# EAGLE design untitled (EAGLE 9.6.2)
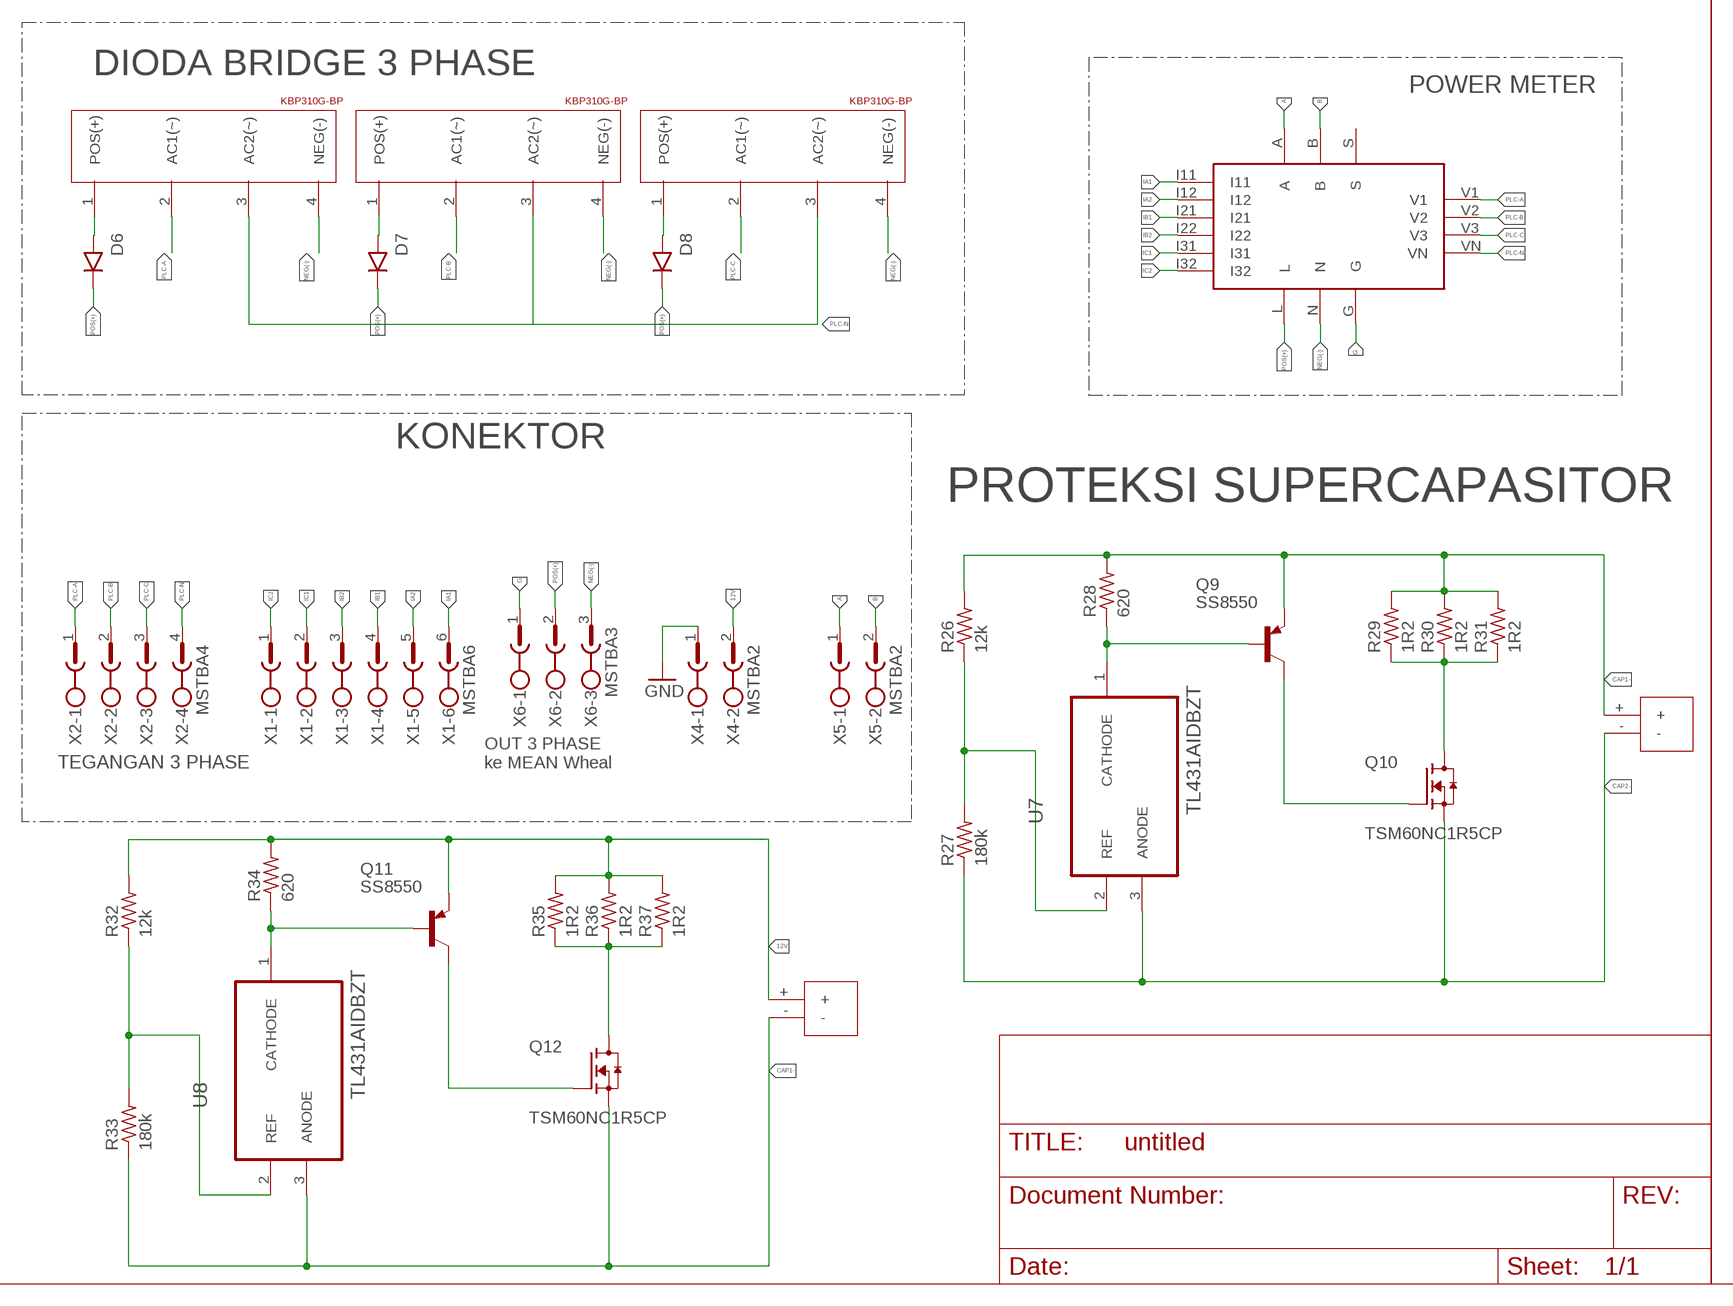
[diagram p0: schematic, sheet 1, part 1 of 2]
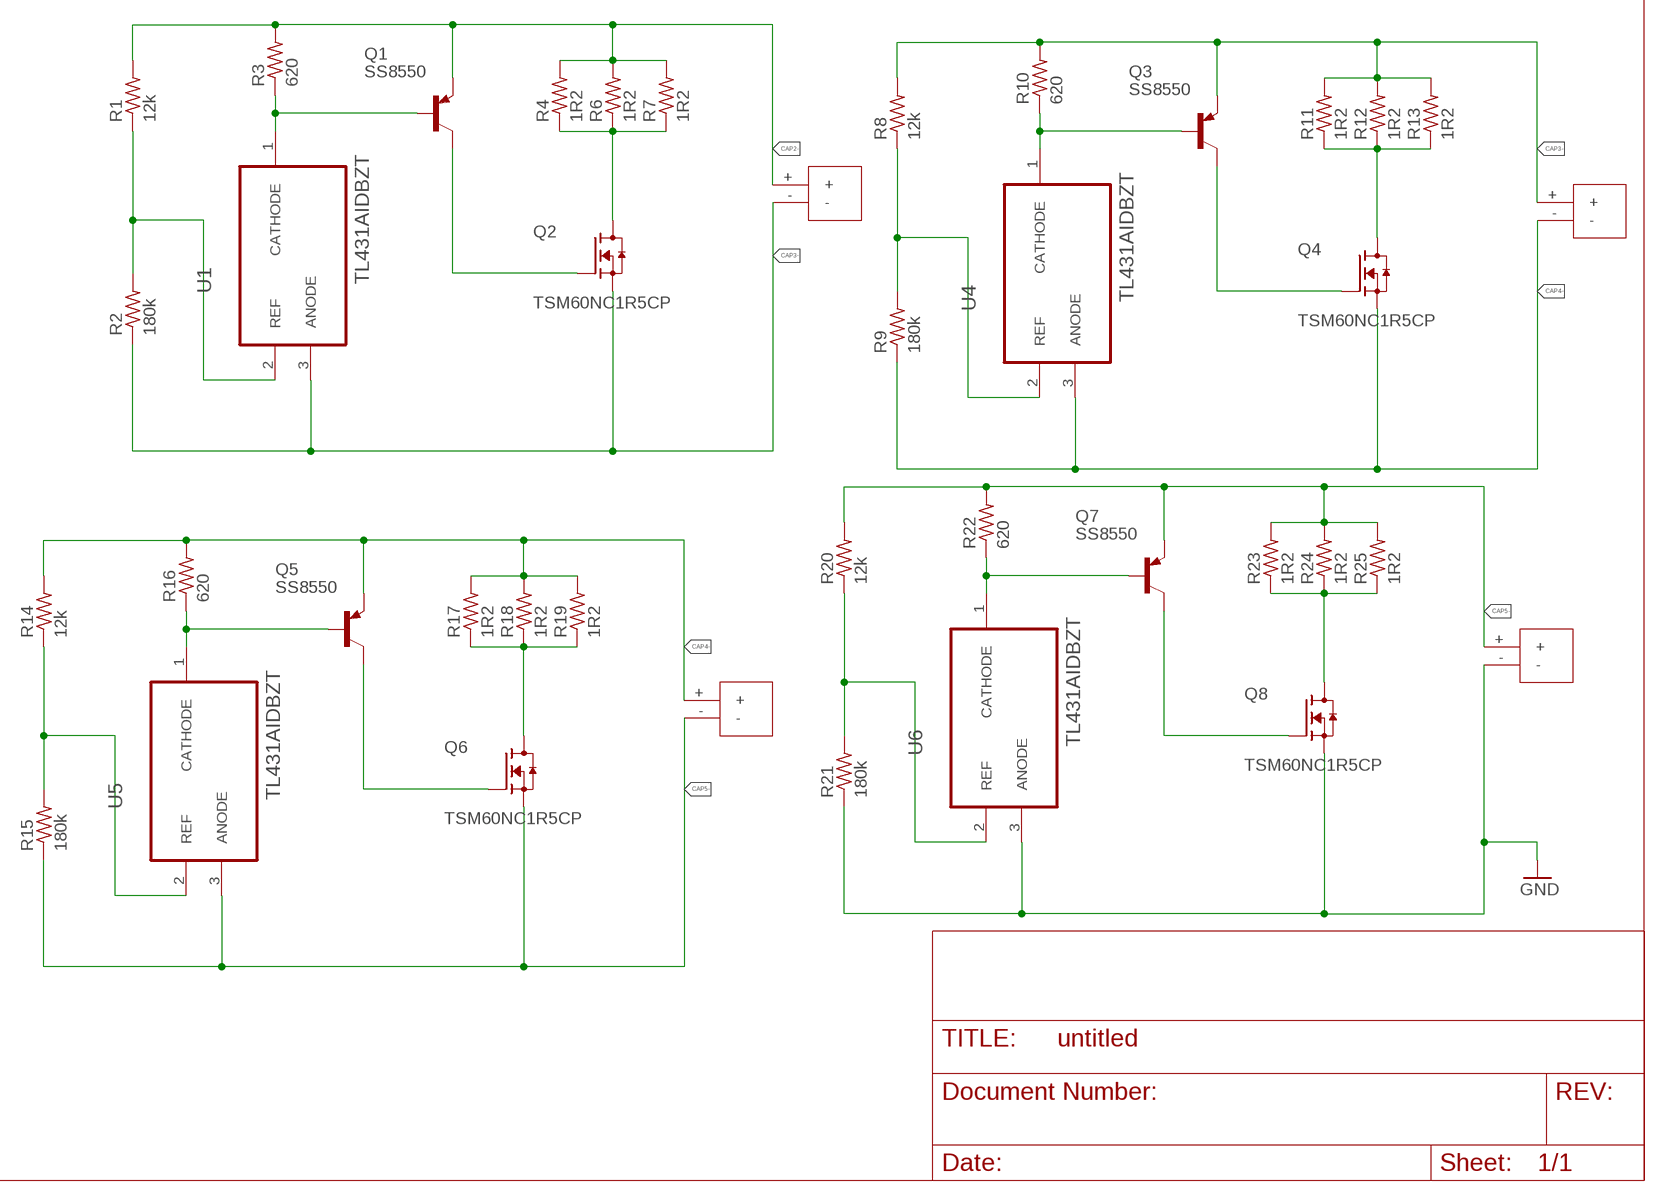
[diagram p1: schematic, sheet 1, part 2 of 2]

## Parts
D6  1N4001  [DO41-10]
D7  1N4001  [DO41-10]
D8  1N4001  [DO41-10]
POWERMETER1  POWERMETER  [POWERMETER]
Q1  SS8550  [SOT-23_BEC]
Q2  TSM60NC1R5CP  [TRANS_TSM60NC1R5CP]
Q3  SS8550  [SOT-23_BEC]
Q4  TSM60NC1R5CP  [TRANS_TSM60NC1R5CP]
Q5  SS8550  [SOT-23_BEC]
Q6  TSM60NC1R5CP  [TRANS_TSM60NC1R5CP]
Q7  SS8550  [SOT-23_BEC]
Q8  TSM60NC1R5CP  [TRANS_TSM60NC1R5CP]
Q9  SS8550  [SOT-23_BEC]
Q10  TSM60NC1R5CP  [TRANS_TSM60NC1R5CP]
Q11  SS8550  [SOT-23_BEC]
Q12  TSM60NC1R5CP  [TRANS_TSM60NC1R5CP]
R1  12k  R-US_R0805  [R0805]
R2  180k  R-US_R0805  [R0805]
R3  620  R-US_R0805  [R0805]
R4  1R2  R-US_R2512  [R2512]
R6  1R2  R-US_R2512  [R2512]
R7  1R2  R-US_R2512  [R2512]
R8  12k  R-US_R0805  [R0805]
R9  180k  R-US_R0805  [R0805]
R10  620  R-US_R0805  [R0805]
R11  1R2  R-US_R2512  [R2512]
R12  1R2  R-US_R2512  [R2512]
R13  1R2  R-US_R2512  [R2512]
R14  12k  R-US_R0805  [R0805]
R15  180k  R-US_R0805  [R0805]
R16  620  R-US_R0805  [R0805]
R17  1R2  R-US_R2512  [R2512]
R18  1R2  R-US_R2512  [R2512]
R19  1R2  R-US_R2512  [R2512]
R20  12k  R-US_R0805  [R0805]
R21  180k  R-US_R0805  [R0805]
R22  620  R-US_R0805  [R0805]
R23  1R2  R-US_R2512  [R2512]
R24  1R2  R-US_R2512  [R2512]
R25  1R2  R-US_R2512  [R2512]
R26  12k  R-US_R0805  [R0805]
R27  180k  R-US_R0805  [R0805]
R28  620  R-US_R0805  [R0805]
R29  1R2  R-US_R2512  [R2512]
R30  1R2  R-US_R2512  [R2512]
R31  1R2  R-US_R2512  [R2512]
R32  12k  R-US_R0805  [R0805]
R33  180k  R-US_R0805  [R0805]
R34  620  R-US_R0805  [R0805]
R35  1R2  R-US_R2512  [R2512]
R36  1R2  R-US_R2512  [R2512]
R37  1R2  R-US_R2512  [R2512]
SUPERCAP1  2.7/500F  SUPERCAP  [SUPERCAP]
SUPERCAP2  2.7/500F  SUPERCAP  [SUPERCAP]
SUPERCAP3  2.7/500F  SUPERCAP  [SUPERCAP]
SUPERCAP4  2.7/500F  SUPERCAP  [SUPERCAP]
SUPERCAP5  2.7/500F  SUPERCAP  [SUPERCAP]
SUPERCAP6  2.7/500F  SUPERCAP  [SUPERCAP]
U1  TL431AIDBZT  [SOT95P237X112-3N]
U4  TL431AIDBZT  [SOT95P237X112-3N]
U5  TL431AIDBZT  [SOT95P237X112-3N]
U6  TL431AIDBZT  [SOT95P237X112-3N]
U7  TL431AIDBZT  [SOT95P237X112-3N]
U8  TL431AIDBZT  [SOT95P237X112-3N]
U$1  KBP310G-BP  [KBP310G-BP]
U$2  KBP310G-BP  [KBP310G-BP]
U$3  KBP310G-BP  [KBP310G-BP]
X1  MSTBA6  [MSTBA6]
X2  MSTBA4  [MSTBA4]
X4  MSTBA2  [MSTBA2]
X5  MSTBA2  [MSTBA2]
X6  MSTBA3  [MSTBA3]

## Nets
12V: Q11.E R32.2 R34.2 R35.2 R36.2 R37.2 SUPERCAP6.+ X4.2
A: POWERMETER1.A X5.1
B: POWERMETER1.B X5.2
CAP1-: Q9.E Q12.3(S) R26.2 R28.2 R29.2 R30.2 R31.2 R33.1 SUPERCAP5.+ SUPERCAP6.- U8.3(ANODE)
CAP2-: Q1.E Q10.3(S) R1.2 R3.2 R4.2 R6.2 R7.2 R27.1 SUPERCAP1.+ SUPERCAP5.- U7.3(ANODE)
CAP3-: Q2.3(S) Q3.E R2.1 R8.2 R10.2 R11.2 R12.2 R13.2 SUPERCAP1.- SUPERCAP2.+ U1.3(ANODE)
CAP4-: Q4.3(S) Q5.E R9.1 R14.2 R16.2 R17.2 R18.2 R19.2 SUPERCAP2.- SUPERCAP3.+ U4.3(ANODE)
CAP5-: Q6.3(S) Q7.E R15.1 R20.2 R22.2 R23.2 R24.2 R25.2 SUPERCAP3.- SUPERCAP4.+ U5.3(ANODE)
G: POWERMETER1.G X6.1
GND: Q8.3(S) R21.1 SUPERCAP4.- U6.3(ANODE) X4.1
IA1: POWERMETER1.I11 X1.6
IA2: POWERMETER1.I12 X1.5
IB1: POWERMETER1.I21 X1.4
IB2: POWERMETER1.I22 X1.3
IC1: POWERMETER1.I31 X1.2
IC2: POWERMETER1.I32 X1.1
N$1: D6.A(ANODE) U$1.1(POS(+))
N$2: D7.A(ANODE) U$2.1(POS(+))
N$3: D8.A(ANODE) U$3.1(POS(+))
N$4: R8.1 R9.2 U4.2(REF)
N$6: R1.1 R2.2 U1.2(REF)
N$18: Q1.B R3.1 U1.1(CATHODE)
N$20: Q1.C Q2.1(G)
N$21: Q2.2(D) R4.1 R6.1 R7.1
N$25: Q3.B R10.1 U4.1(CATHODE)
N$26: Q3.C Q4.1(G)
N$27: Q4.2(D) R11.1 R12.1 R13.1
N$29: R14.1 R15.2 U5.2(REF)
N$31: Q5.B R16.1 U5.1(CATHODE)
N$32: Q5.C Q6.1(G)
N$33: Q6.2(D) R17.1 R18.1 R19.1
N$35: R20.1 R21.2 U6.2(REF)
N$37: Q7.B R22.1 U6.1(CATHODE)
N$38: Q7.C Q8.1(G)
N$39: Q8.2(D) R23.1 R24.1 R25.1
N$41: R26.1 R27.2 U7.2(REF)
N$43: Q9.B R28.1 U7.1(CATHODE)
N$44: Q9.C Q10.1(G)
N$45: Q10.2(D) R29.1 R30.1 R31.1
N$47: R32.1 R33.2 U8.2(REF)
N$49: Q11.B R34.1 U8.1(CATHODE)
N$50: Q11.C Q12.1(G)
N$51: Q12.2(D) R35.1 R36.1 R37.1
NEG(-): POWERMETER1.N U$1.4(NEG(-)) U$2.4(NEG(-)) U$3.4(NEG(-)) X6.3
PLC-A: POWERMETER1.V1 U$1.2(AC1(~)) X2.1
PLC-B: POWERMETER1.V2 U$2.2(AC1(~)) X2.2
PLC-C: POWERMETER1.V3 U$3.2(AC1(~)) X2.3
PLC-N: POWERMETER1.VN U$1.3(AC2(~)) U$2.3(AC2(~)) U$3.3(AC2(~)) X2.4
POS(+): D6.C(CATHODE) D7.C(CATHODE) D8.C(CATHODE) POWERMETER1.L X6.2
Unconnected: POWERMETER1.S

## Notes on the sheet
- DIODA BRIDGE 3 PHASE
- POWER METER
- KONEKTOR
- PROTEKSI SUPERCAPASITOR
- TEGANGAN 3 PHASE
- OUT 3 PHASE 
  ke MEAN Wheal

## Library data of the parts
D6-D8 = 1N4001:1N4001: DIODE general purpose rectifier, 1 A Check availability <https://pricing.snapeda.com/parts/1N4001/HVCA/view-part?ref=eda>; AVAILABILITY: In Stock; CHECK_PRICES: https://www.snapeda.com/parts/1N4001/HVCA/view-part/?ref=eda; DESCRIPTION: Diode, Rectifier, Vr 50V, If 1A, Pkg DO-41, Vf 1.1V, Cs 30A, Ir 1A | HVCA 1N4001; MF: HVCA; MP: 1N4001; PACKAGE: None; PRICE: None; SNAPEDA_LINK: https://www.snapeda.com/parts/1N4001/HVCA/view-part/?ref=snap
POWERMETER1 = POWERMETER:POWERMETER
Q1 Q3 Q5 Q7 Q9 Q11 = SS8550:SS8550: PNP de proposito general Vce=-40V, Ic-1.5A - 0.3W Check availability <https://pricing.snapeda.com/parts/SS8550/ON%20Semiconductor%20/%20Fairchild/view-part?ref=eda>; AVAILABILITY: In Stock; DESCRIPTION: Bipolar Transistors - BJT NPN/40V/1.5A; MF: ON Semiconductor / Fairchild; MP: SS8550; PACKAGE: SOT-23 ON Semiconductor / Fairchild; PRICE: None; PURCHASE-URL: https://pricing.snapeda.com/search/part/SS8550/?ref=eda
Q2 Q4 Q6 Q8 Q10 Q12 = TSM60NC1R5CP:TSM60NC1R5CP: Check availability <https://pricing.snapeda.com/parts/TSM60NC1R5CP/Taiwan%20Semiconductor/view-part?ref=eda>; AVAILABILITY: In Stock; CHECK_PRICES: https://www.snapeda.com/parts/TSM60NC1R5CP/Taiwan+Semiconductor/view-part/?ref=eda; DESCRIPTION: 600V, 3A, SINGLE N-CHANNEL POWER; MF: Taiwan Semiconductor; MP: TSM60NC1R5CP; PACKAGE: TO-252 Taiwan Semiconductor; PRICE: None; SNAPEDA_LINK: https://www.snapeda.com/parts/TSM60NC1R5CP/Taiwan+Semiconductor/view-part/?ref=snap
R1-R3 R8-R10 R14-R16 R20-R22 R26-R28 R32-R34 = adafruit:R-US_: RESISTOR, American symbol
R4 R6 R7 R11-R13 R17-R19 R23-R25 R29-R31 R35-R37 = rcl:R-US_: RESISTOR, American symbol; SPICEPREFIX: R
SUPERCAP1-SUPERCAP6 = SUPERCAP:SUPERCAP
U1 U4-U8 = TL431AIDBZT:TL431AIDBZT: PRECISION PROGRAMMABLE REFERENCE Check availability <https://pricing.snapeda.com/parts/TL431AIDBZT/Texas%20Instruments/view-part?ref=eda>; AVAILABILITY: In Stock; CHECK_PRICES: https://www.snapeda.com/parts/TL431AIDBZT/Texas+Instruments/view-part/?ref=eda; DESCRIPTION: Adjustable precision shunt regulator; MF: Texas Instruments; MP: TL431AIDBZT; PACKAGE: SOT-23-3 Texas Instruments; PRICE: None; SNAPEDA_LINK: https://www.snapeda.com/parts/TL431AIDBZT/Texas+Instruments/view-part/?ref=snap
U$1-U$3 = KBP310G-BP:KBP310G-BP: Check availability <https://pricing.snapeda.com/parts/KBP310G-BP/Micro%20Commercial/view-part?ref=eda>; AVAILABILITY: In Stock; CHECK_PRICES: https://www.snapeda.com/parts/KBP310G-BP/Micro+Commercial+Components/view-part/?ref=eda; DESCRIPTION: Bridge Rectifier Single Phase Standard 1 kV Through Hole GBP; MF: Micro Commercial; MP: KBP310G-BP; PACKAGE: SIP-4 Micro Commercial Co; PRICE: None; SNAPEDA_LINK: https://www.snapeda.com/parts/KBP310G-BP/Micro+Commercial+Components/view-part/?ref=snap
X1 = con-phoenix-508:MSTBA6: PHOENIX; MF: FARNELL; MPN: 1757284; OC_FARNELL: 3705213; OC_NEWARK: 71C4165
X2 = con-phoenix-508:MSTBA4: PHOENIX; MF: FARNELL; MPN: 1757268; OC_FARNELL: 3705195; OC_NEWARK: 71C4163
X4 X5 = con-phoenix-508:MSTBA2: PHOENIX; MF: FARNELL; MPN: 1757242; OC_FARNELL: 3705171; OC_NEWARK: 71C4161
X6 = con-phoenix-508:MSTBA3: PHOENIX; MF: FARNELL; MPN: 1757255; OC_FARNELL: 3705183; OC_NEWARK: 71C4162

## Board
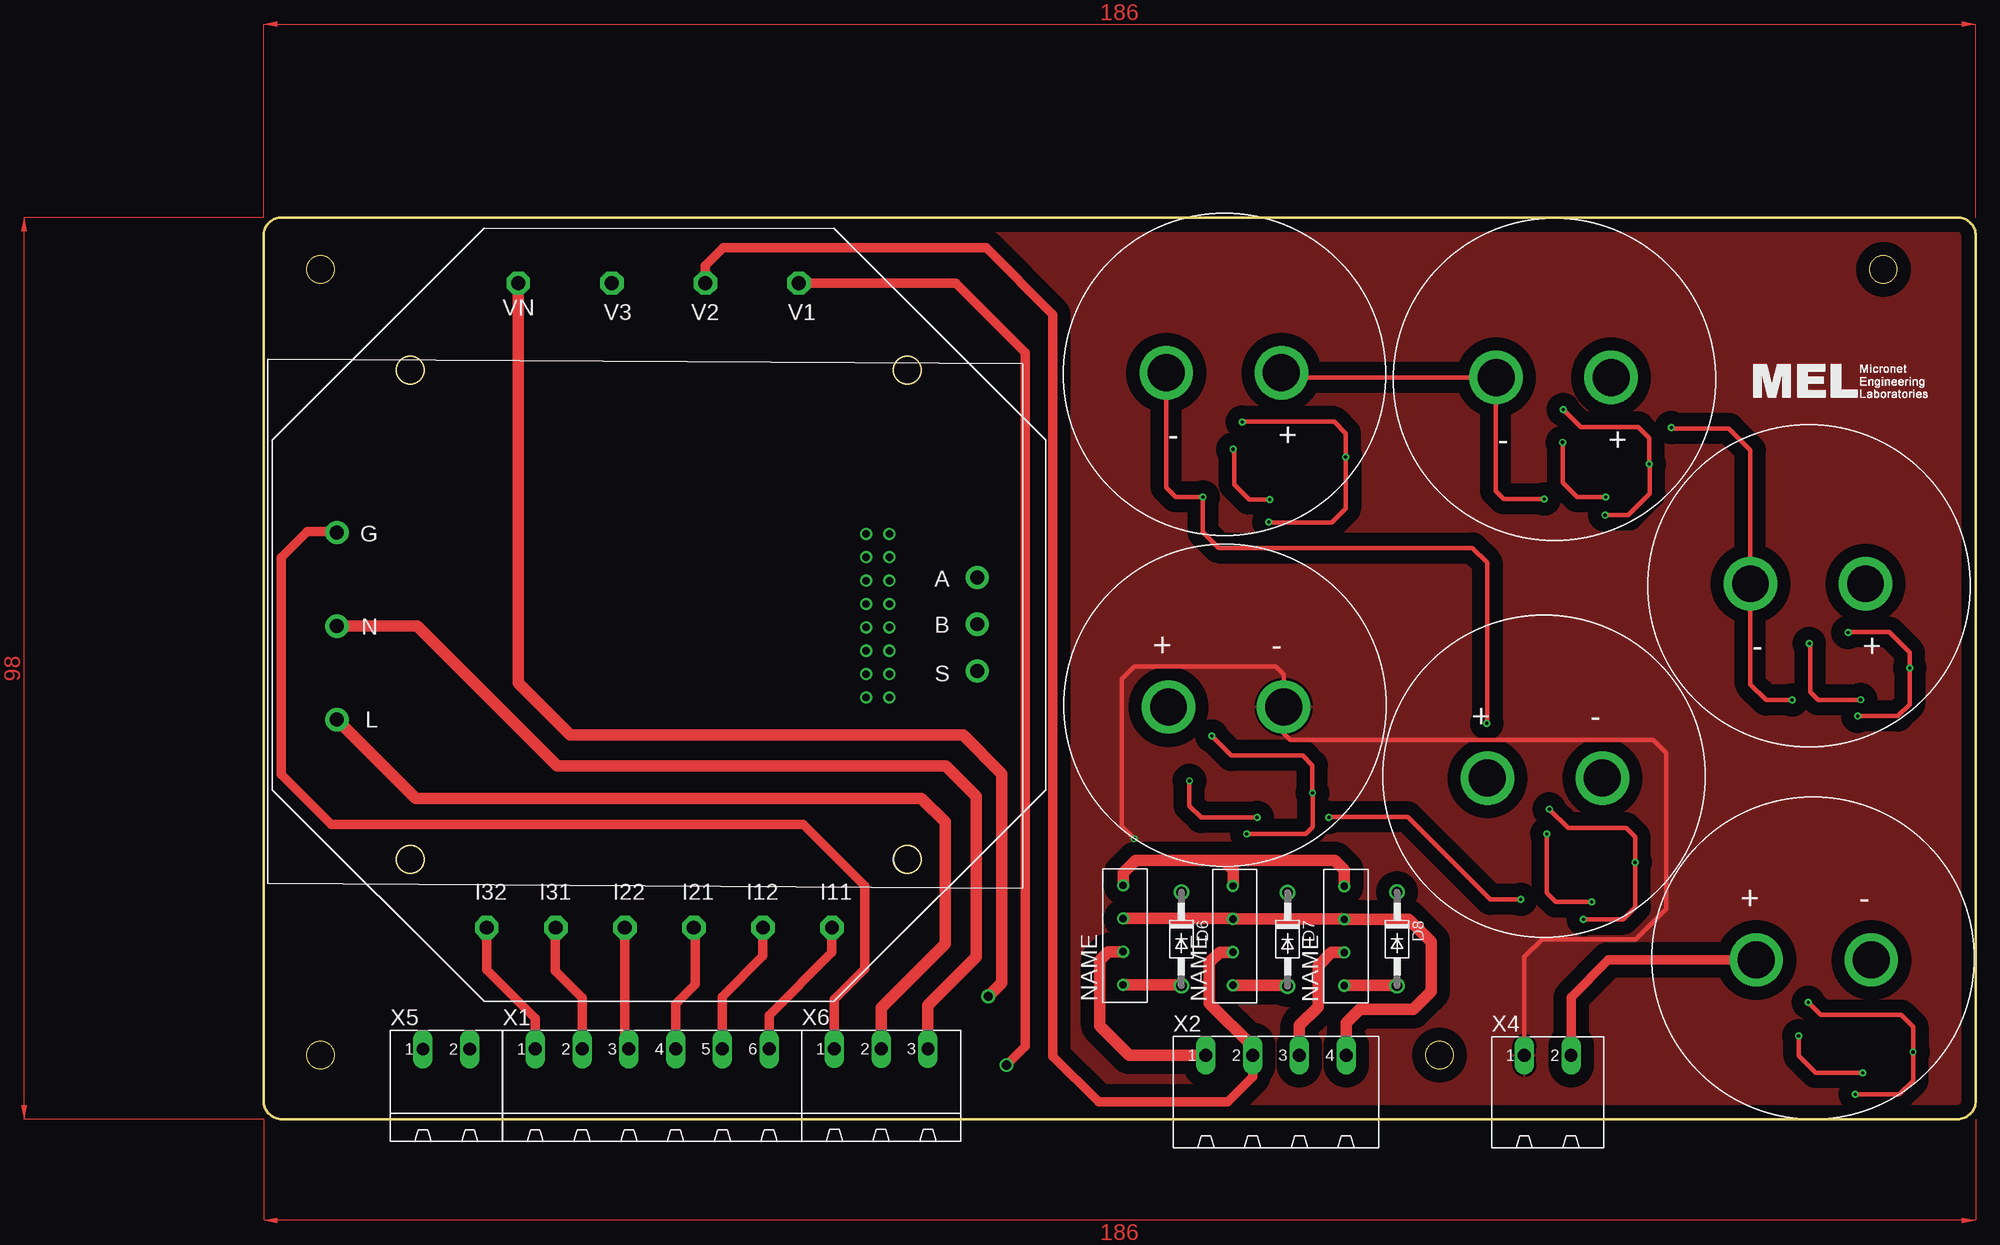
[diagram p2: board, top side]
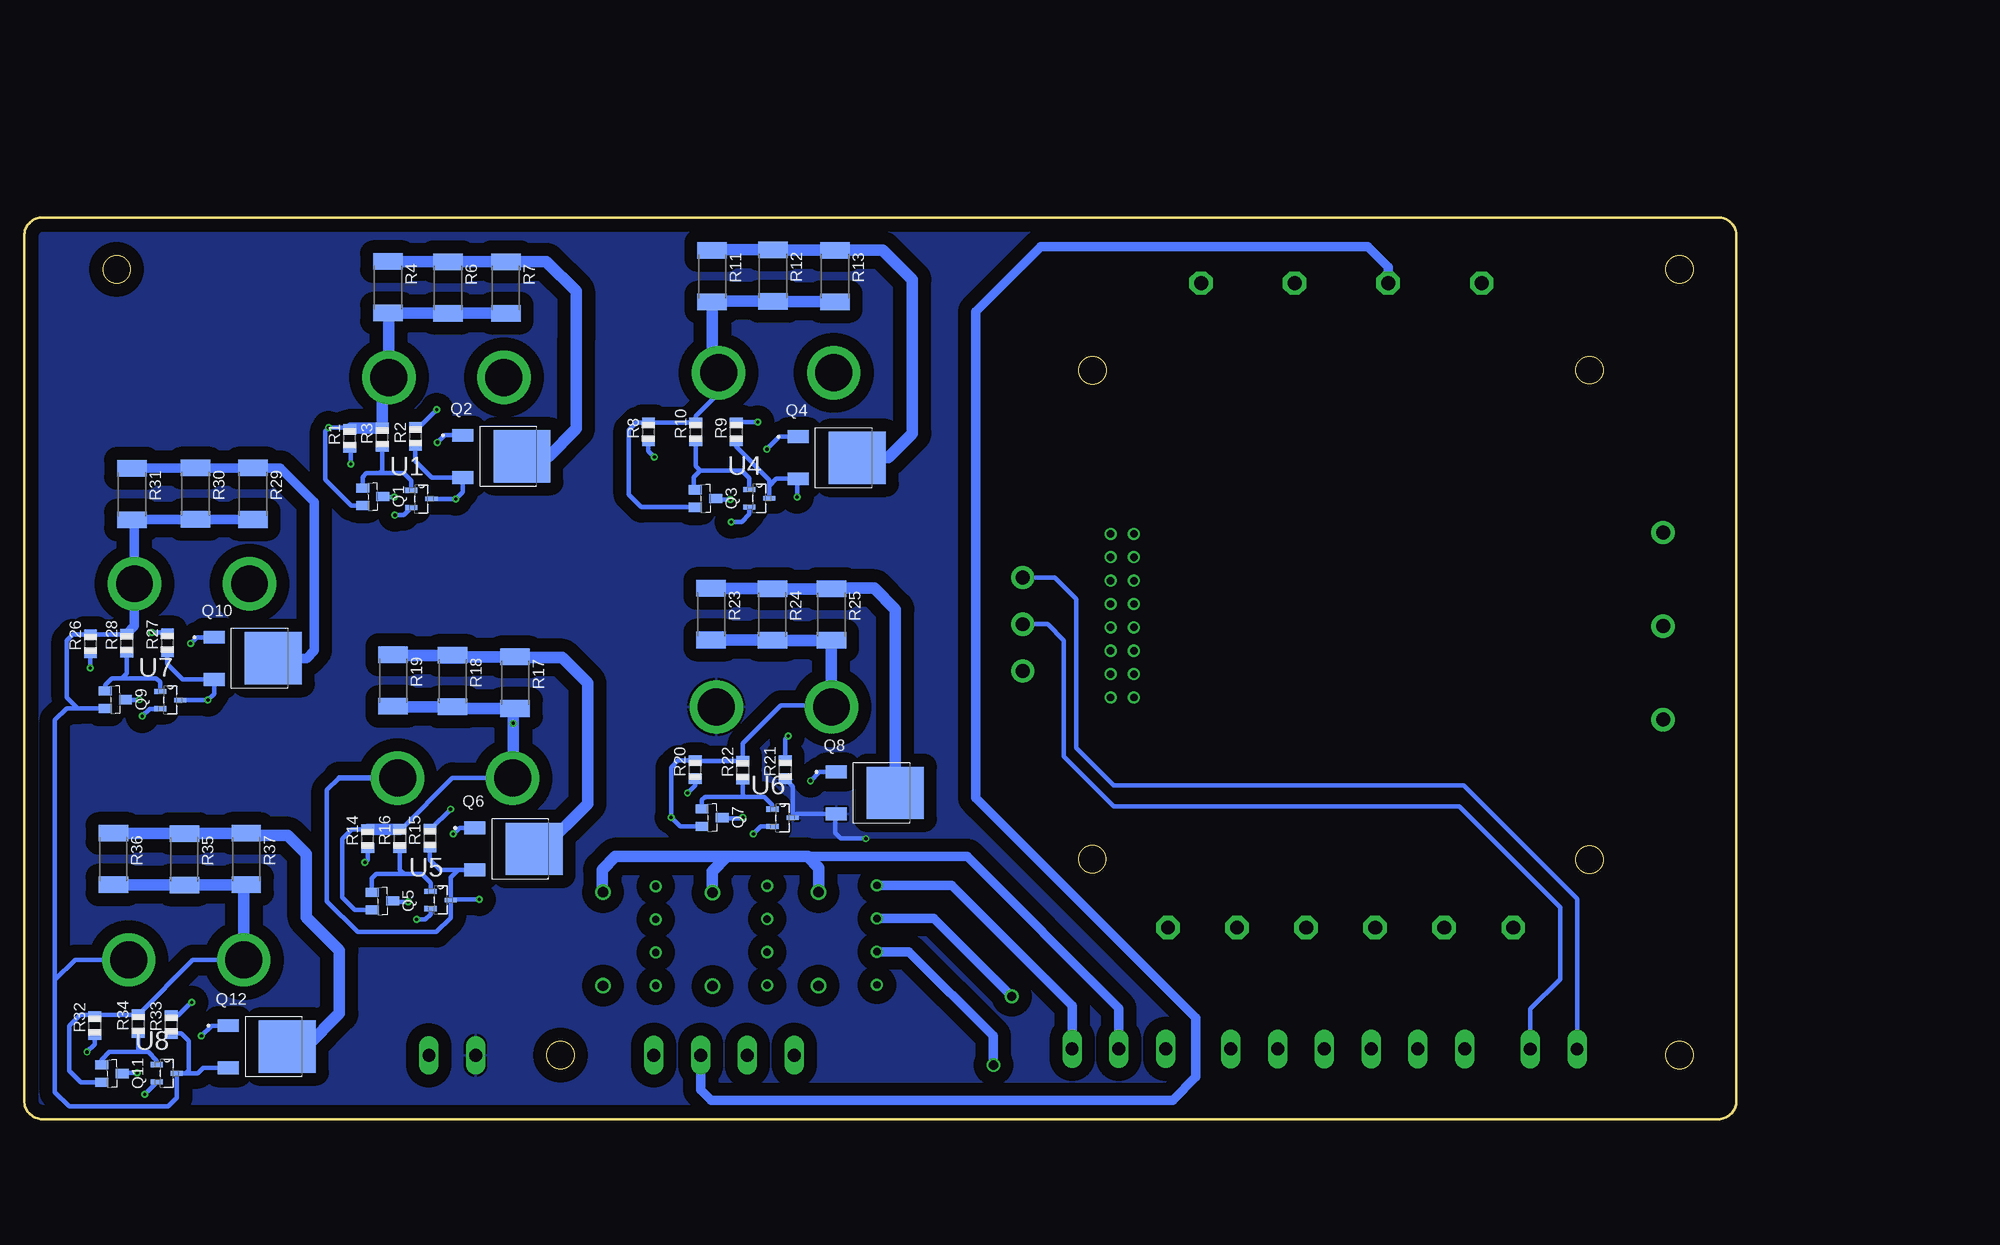
[diagram p3: board, bottom side, seen from below]

Size 186 x 98 mm. Coordinates in mm from the lower left corner, seen from the top.
Outline: 186,2 arc-90 184,0 2,0 arc-90 0,2 0,96 arc-90 2,98 184,98 arc-90 186,96 186,2
Outline: circle at 15.96,81.41 radius 1.5
Outline: circle at 69.95,81.39 radius 1.5
Outline: circle at 69.98,28.26 radius 1.5
Outline: circle at 15.96,28.23 radius 1.5
Outline: circle at 6.21,6.97 radius 1.5
Outline: circle at 6.21,92.34 radius 1.5
Outline: circle at 175.95,92.34 radius 1.5
Outline: circle at 127.75,6.97 radius 1.5
Copper layers (1*16): Top 0.035mm / dielectric 1.5mm / Bottom 0.035mm
Design rules "default": minimum track width 6mil, minimum drill 0.35mm, track to track 6mil, track to pad 6mil, pad to pad 6mil, via to via 6mil, smd to smd 6mil, copper to edge 40mil, drill to drill 6mil, minimum pad ring 10mil, minimum via ring 8mil, stop-mask expansion 4mil, vias tented up to drill 0mil, thermal gap 10mil

### Footprints (pad centres in the part's own frame; a part is rotated, then mirrored left to right if it is on the bottom)
DO41-10 = drill 1.118: A 5.08,0; C -5.08,0
POWERMETER = drill 1.5 pad 2.54: A 53.58,-37.94; B 53.58,-43.02; G -15.98,-33.06; L -15.98,-53.38; N -15.98,-43.22; S 53.58,-48.1 | drill 1.5 pad 2.54 octagon: I11 37.8,-76; I12 30.3,-76; I21 22.8,-76; I22 15.3,-76; I31 7.8,-76; I32 0.3,-76; V1 34.204,-5.954; V2 24.044,-5.954; V3 13.884,-5.954; VN 3.724,-5.954 | drill 0.8: P$7 44.04,-33.2; P$8 44.04,-35.74; P$9 44.04,-38.28; P$10 44.04,-40.82; P$11 44.04,-43.36; P$12 44.04,-45.9; P$13 44.04,-48.44; P$14 44.04,-50.98; P$15 41.5,-33.2; P$16 41.5,-35.74; P$17 41.5,-38.28; P$18 41.5,-40.82; P$19 41.5,-43.36; P$20 41.5,-45.9; P$21 41.5,-48.44; P$22 41.5,-50.98
SOT-23_BEC = smd 1 x 1.4: B -0.95,-1.1; C 0,1.1; E 0.95,-1.1
TRANS_TSM60NC1R5CP = smd 2.29 x 1.4: 1 -4.19,2.285; 3 -4.19,-2.285 | smd 6.18 x 5.69: 2 2.245,0
R0805 = smd 1.1 x 1.4: 1 -1,0; 2 1,0
R2512 = smd 1.8 x 3.2: 1 -2.8,0; 2 2.8,0
SUPERCAP = drill 4 pad 5.8: + 2.34,4.01; - -10.16,4.01
SOT95P237X112-3N = smd 1.321 x 0.559: 1 -1.092,0.94; 2 -1.092,-0.94 | smd 1.321 x 0.508: 3 1.092,0
KBP310G-BP = drill 0.8: 1 -5.5,0; 2 -1.9,0; 3 1.7,0; 4 5.3,0
MSTBA6 = drill 1.397 long: 1 -12.7,5.08; 2 -7.62,5.08; 3 -2.54,5.08; 4 2.54,5.08; 5 7.62,5.08; 6 12.7,5.08
MSTBA4 = drill 1.397 long: 1 -7.62,5.08; 2 -2.54,5.08; 3 2.54,5.08; 4 7.62,5.08
MSTBA2 = drill 1.397 long: 1 -2.54,5.08; 2 2.54,5.08
MSTBA3 = drill 1.397 long: 1 -5.08,5.08; 2 0,5.08; 3 5.08,5.08

### Placement (x,y rotation side)
D6  99.7,19.58 270 top
D7  111.25,19.55 270 top
D8  123.13,19.58 270 top
POWERMETER1  23.95,96.81 0 top
Q1  148.14,67.66 270 bottom
Q2  134.16,72.04 0 bottom
Q3  111.99,67.45 270 bottom
Q4  97.74,71.88 0 bottom
Q5  147.09,23.71 270 bottom
Q6  132.85,29.38 0 bottom
Q7  111.27,32.77 270 bottom
Q8  93.61,35.45 0 bottom
Q9  176.1,45.59 270 bottom
Q10  161.18,50.09 0 bottom
Q11  176.47,4.95 270 bottom
Q12  159.65,7.89 0 bottom
R1  150.65,74.02 90 bottom
R2  143.5,74.2 90 bottom
R3  147.12,74.13 90 bottom
R4  146.49,90.41 270 bottom
R6  139.97,90.39 270 bottom
R7  133.68,90.38 270 bottom
R8  118.19,74.71 90 bottom
R9  108.66,74.69 90 bottom
R10  113.04,74.69 90 bottom
R11  111.27,91.61 270 bottom
R12  104.66,91.68 270 bottom
R13  97.93,91.64 270 bottom
R14  148.7,30.47 90 bottom
R15  141.92,30.53 90 bottom
R16  145.19,30.52 90 bottom
R17  132.67,47.44 270 bottom
R18  139.46,47.61 270 bottom
R19  145.92,47.68 270 bottom
R20  113.13,37.97 90 bottom
R21  103.34,37.99 90 bottom
R22  107.94,37.94 90 bottom
R23  111.38,54.88 270 bottom
R24  104.72,54.86 270 bottom
R25  98.31,54.85 270 bottom
R26  178.8,51.68 90 bottom
R27  170.44,51.78 90 bottom
R28  174.85,51.75 90 bottom
R29  161.15,67.97 270 bottom
R30  167.39,67.98 270 bottom
R31  174.3,67.94 270 bottom
R32  178.33,10.17 90 bottom
R33  170.03,10.31 90 bottom
R34  173.62,10.37 90 bottom
R35  168.6,28.25 270 bottom
R36  176.31,28.27 270 bottom
R37  161.88,28.27 270 bottom
SUPERCAP1  144.05,76.6 0 top
SUPERCAP2  108.22,77.12 0 top
SUPERCAP3  135.28,41.08 180 top
SUPERCAP4  100.65,48.81 180 top
SUPERCAP5  171.68,54.18 0 top
SUPERCAP6  164.49,21.32 180 top
U1  142.85,67.41 0 bottom
U4  106.15,67.48 0 bottom
U5  140.77,23.82 0 bottom
U6  103.62,32.76 0 bottom
U7  170.14,45.55 0 bottom
U8  170.51,4.99 0 bottom
U$1  93.37,20.11 90 top
U$2  105.3,20.06 90 top
U$3  117.39,20.02 90 top
X1  42.22,2.55 0 top
X2  109.98,1.88 0 top
X4  139.49,1.87 0 top
X5  19.86,2.55 0 top
X6  67.09,2.57 0 top

### Tracks (layer width: path | path; a pad name or v marks a point on that pad's centre or on a via)
12V
  Top 1.016: X4.2 142.03,13.26 146.09,17.31 SUPERCAP6.+
  Bottom 0.508: 178.13,11.37 R34.2 167.68,17.31 SUPERCAP6.+ | 178.13,11.37 R32.2 | Q11.E 179.88,4 181.13,5.26 181.13,10.15 179.91,11.37 178.13,11.37
  Bottom 1.27: R36.2 176.29,25.45 R35.2 168.58,25.47 R37.2 162.15,25.2 SUPERCAP6.+
A
  Bottom 0.508: X5.1 17.32,23.96 29.64,36.28 67.64,36.28 71.71,40.35 71.71,56.52 74.06,58.87 POWERMETER1.A
B
  Bottom 0.508: X5.2 22.4,11.98 19.17,15.22 19.17,23.04 30.12,33.98 67.65,33.98 73.07,39.4 73.07,52.03 74.83,53.79 POWERMETER1.B
CAP1-
  Bottom 0.508: R28.2 174.92,52.68 R26.2 180.73,52.68 181.37,52.05 181.37,45.81 180.2,44.64 179.81,44.64 | Q9.E 179.81,44.64 | 168.46,4.99 U8.3 169.41,2.32 170.34,1.4 181.13,1.4 182.66,2.92 182.66,15.12 | 168.46,4.99 167.14,4.99 166.53,5.6 Q12.3 | R33.1 168.92,9.31 168.12,8.51 168.12,5.33 168.46,4.99 | SUPERCAP6.- 180.47,17.31 182.66,15.12 | 182.66,15.12 182.66,43.41 181.4,44.66 179.82,44.66 179.81,44.64
  Bottom 1.016: R29.2 R30.2 173.48,65.18 173.93,64.73 174.02,64.82 | R31.2 174.3,65.1 174.02,64.82 | 174.02,64.82 SUPERCAP5.+ 174.02,53.58 R28.2
CAP2-  (via drill 0.35)
  Top 0.508: v166.04,45.55 163.23,45.55 161.52,47.26 SUPERCAP5.- 161.52,72.72 159.17,75.07 152.76,75.07 152.85,75.16 v152.93,75.16
  Bottom 0.508: U7.3 v166.04,45.55 165.37,46.22 Q10.3 168.78,47.81 170.44,49.47 R27.1 | Q1.E 150.49,66.71 153.29,69.5 153.29,74.8 v152.93,75.16 150.56,75.16 150.54,75.13
  Bottom 1.27: R7.2 R6.2 139.99,87.61 R4.2 146.39,87.52 SUPERCAP1.+ 147.12,79.88 R3.2 150.54,75.13 R1.2
CAP3-  (via drill 0.35)
  Top 0.508: v139.11,67.41 134.71,67.41 133.83,68.29 133.83,80.54 SUPERCAP1.- 111.08,80.61 SUPERCAP2.+
  Bottom 0.508: U1.3 v139.11,67.41 138.35,68.17 Q2.3 141.73,69.75 143.5,71.52 R2.1 | SUPERCAP2.+ 110.55,81.11 110.55,78.91 113.04,76.42 R10.2 113.05,75.71 R8.2 119.51,75.71 120.31,74.91 120.31,67.87 118.95,66.5 Q3.E
  Bottom 1.27: R13.2 104.62,88.84 R12.2 111.2,88.88 R11.2 111.27,81.83 SUPERCAP2.+
CAP4-  (via drill 0.35)
  Top 0.508: SUPERCAP2.- 98.04,81.11 98.04,68.67 99.09,67.62 v102.05,67.62 102.05,63.8 103.74,62.1 131.31,62.1 132.92,60.5 132.92,43.05 132.89,43.05 v132.87,43.03
  Bottom 0.508: Q5.E 150.1,22.77 151.44,24.11 151.44,30.47 150.43,31.48 R14.2 | R16.2 145.07,31.52 139.49,37.09 132.96,37.09 SUPERCAP3.+ | U4.3 105.06,68.82 | 105.06,68.82 104.28,69.6 Q4.3 102.05,69.48 v102.05,67.62 | R9.1 108.66,73.07 105.06,69.47 105.06,68.82
  Bottom 1.27: R19.2 145.86,44.81 R18.2 139,44.81 138.83,44.64 R17.2 132.87,44.44 v132.87,43.03 132.87,37.14 SUPERCAP3.+ | R16.2 148.66,31.52 R14.2
CAP5-  (via drill 0.35)
  Top 0.508: v136.58,23.88 133.27,23.88 124.29,32.85 115.73,32.85 v115.73,32.81 v115.73,32.8
  Bottom 0.508: U5.3 139.68,26.27 138.85,27.09 138.21,27.09 | 138.21,27.09 Q6.3 | R15.1 141.92,28.17 140.83,27.08 138.23,27.08 138.21,27.09 | U5.3 139.68,21.89 141.22,20.34 149.79,20.34 153.11,23.67 153.11,35.78 151.79,37.1 | Q7.E 114.75,31.82 v115.73,32.8 115.73,38.25 115.01,38.98 R20.2 113.1,38.95 R22.2 107.94,40.83 103.81,44.95 98.46,44.95 SUPERCAP4.+ | U5.3 139.62,23.88 v136.58,23.88
  Bottom 0.61: 145.47,37.1 151.79,37.1
  Bottom 1.27: SUPERCAP3.- 145.47,37.1 | R23.2 111.35,52.06 R24.2 104.71,52.05 R25.2 SUPERCAP4.+
G
  Top 1.016: X6.1 62.01,13.05 65.3,16.34 65.3,25.36 58.63,32.02 7.36,32.02 1.91,37.48 1.91,61.02 4.76,63.88 7.84,63.88 POWERMETER1.G
GND  (via drill 0.35)
  Top 0.508: v94.56,30.49 93.23,31.83 93.23,47.82 94.61,49.2 109.94,49.2 110.81,48.33 SUPERCAP4.- 110.81,41.94 111.52,41.23 150.95,41.23 151.24,40.93 152.35,39.82 152.35,22.86 149.05,19.55 138.88,19.55 136.95,17.62 X4.1
  Bottom 0.508: R21.1 102.53,36.18 U6.3 102.12,33.17 Q8.3 97.91,33.07 97.91,31.12 97.28,30.49 v94.56,30.49
  pour Top (isolate 1.422): 0,98 186,98 186,0 0,0
  pour Bottom (isolate 1.422): 0,98 186,98 186,0 0,0
IA1
  Top 1.016: X1.6 54.92,11.3 61.75,18.13 POWERMETER1.I11
IA2
  Top 1.016: X1.5 49.84,13.32 54.25,17.73 POWERMETER1.I12
IB1
  Top 1.016: X1.4 44.76,12.54 46.88,14.65 46.88,20.68 POWERMETER1.I21
IB2
  Top 1.016: POWERMETER1.I22 39.25,8.07 X1.3
IC1
  Top 1.016: X1.2 34.6,13.21 31.7,16.11 31.7,20.76 POWERMETER1.I31
IC2
  Top 1.016: X1.1 29.52,10.95 24.25,16.22 POWERMETER1.I32
N$1
  Top 1.27: U$1.1 99.6,14.61 D6.A
N$2
  Top 1.27: U$2.1 111.16,14.56 D7.A
N$3
  Top 1.27: U$3.1 123.11,14.52 D8.A
N$4  (via drill 0.35)
  Top 0.508: v109.18,64.91 109.25,64.84 115.72,64.84 116.04,64.84 117.54,66.34 v117.54,71.95 117.54,74.54 116.29,75.79 106.35,75.79 v106.33,75.77
  Bottom 0.508: R8.1 118.19,72.6 v117.54,71.95 | v109.18,64.91 108.08,64.91 107.24,65.74 U4.2 | v106.33,75.77 108.59,75.77 R9.2
N$6  (via drill 0.35)
  Top 0.508: v145.73,65.64 148.26,65.64 150.61,67.99 150.61,71.13 v150.54,71.2 150.54,74.05 149.34,75.24 143.06,75.24 v141.19,77.12
  Bottom 0.508: U1.2 144.78,65.64 v145.73,65.64 | v150.54,71.2 150.54,72.9 R1.1 | v141.19,77.12 143.1,75.2 R2.2
N$18
  Bottom 0.508: U1.1 143.95,69.39 144.76,70.2 147.44,70.2 | 147.44,70.2 148.83,70.2 149.25,69.78 Q1.B | R3.1 147.12,70.52 147.44,70.2
N$20  (via drill 0.35)
  Top 0.508: v145.79,67.62 142.68,67.62 141.11,69.19 v141.11,73.55
  Bottom 0.508: Q1.C 147,67.62 v145.79,67.62 | v141.11,73.55 140.34,74.32 Q2.1
N$21
  Bottom 1.27: R4.1 141.11,93.21 141.02,93.13 140.03,93.13 R6.1 R7.1 129.26,93.18 126.05,89.97 126.05,84.6 126.05,82.75 126.05,75.03 129.05,72.04 Q2.2
N$25
  Bottom 0.508: U4.1 107.24,69.66 108.08,70.49 112.57,70.49 | 112.57,70.49 113.25,69.81 113.25,68.56 Q3.B | R10.1 113.04,70.96 112.57,70.49
N$26  (via drill 0.35)
  Top 0.508: v109.32,67.34 107.07,67.34 105.44,68.97 105.44,72.81 v105.31,72.81
  Bottom 0.508: Q3.C 110.78,67.34 v109.32,67.34 | v105.31,72.81 103.95,74.17 Q4.1
N$27
  Bottom 1.27: R11.1 111.2,94.48 R12.1 104.62,94.44 R13.1 92.73,94.44 89.51,91.22 89.51,74.51 92.14,71.88 Q4.2
N$29  (via drill 0.35)
  Top 0.508: v139.68,33.69 141.72,31.66 148.02,31.66 148.99,30.69 v148.99,27.91 149.01,27.89 149.01,23.03 147.71,21.73 v143.38,21.73
  Bottom 0.508: R14.1 148.7,28.2 v148.99,27.91 | R15.2 141.85,31.53 v139.68,33.69 | U5.2 141.86,22.28 142.41,21.73 v143.38,21.73
N$31
  Bottom 0.508: U5.1 141.86,25.7 142.81,26.65 144.73,26.65 | 144.73,26.65 147.76,26.65 148.24,26.18 148.24,24.71 Q5.B | R16.1 145.19,27.11 144.73,26.65
N$32  (via drill 0.35)
  Top 0.508: v139.39,31 139.39,24.6 140.38,23.61 v144.28,23.61
  Bottom 0.508: Q6.1 138.68,31.66 139.37,30.98 v139.39,31 | v144.28,23.61 145.88,23.61 Q5.C
N$33
  Bottom 1.27: R19.1 145.86,50.41 R18.1 139.28,50.24 R17.1 132.59,50.15 127.56,50.15 124.8,47.39 124.8,34.28 129.71,29.38 Q6.2
N$35  (via drill 0.35)
  Top 0.508: v103,41.64 105.13,39.51 112.9,39.51 113.94,38.47 v113.94,35.46 113.96,35.45 113.96,31.78 113.19,31.02 v106.79,31.02
  Bottom 0.508: R20.1 113.12,36.28 v113.94,35.46 | v103,41.64 103.34,41.31 R21.2 | U6.2 105.98,31.82 v106.79,31.02
N$37
  Bottom 0.508: U6.1 104.71,34.13 105.59,35.01 107.7,35.01 | 107.7,35.01 112.04,35.01 112.37,34.68 Q7.B | R22.1 107.94,35.25 107.7,35.01
N$38  (via drill 0.35)
  Top 0.508: v107.93,32.78 101.84,32.78 100.55,34.07 100.55,36.79 v100.59,36.79
  Bottom 0.508: Q7.C 110.08,32.68 108,32.68 107.93,32.76 v107.93,32.78 | v100.59,36.79 99.63,37.74 Q8.1
N$39
  Bottom 1.27: R23.1 111.35,57.66 R24.1 104.71,57.65 R25.1 98.25,57.7 93.66,57.7 91.37,55.41 Q8.2
N$41  (via drill 0.35)
  Top 0.508: v173.18,43.8 177.55,43.8 178.81,45.07 v178.81,49.03 178.81,50.71 176.6,52.92 172.16,52.92 v172.12,52.88
  Bottom 0.508: R26.1 v178.8,49.04 v178.81,49.03 | v173.18,43.8 172.38,44.61 U7.2 | v172.12,52.88 170.55,52.88 R27.2
N$43
  Bottom 0.508: Q9.B 177.2,47.21 176.51,47.9 175.39,47.9 | 175.39,47.9 171.63,47.9 171.23,47.5 U7.1 | R28.1 174.85,48.44 175.39,47.9
N$44  (via drill 0.35)
  Top 0.508: v173.48,45.59 168.88,45.59 168.02,46.44 168.02,51.61 v167.93,51.71
  Bottom 0.508: Q9.C v173.48,45.59 | v167.93,51.71 167.26,52.38 Q10.1
N$45
  Bottom 0.508: R30.1 166.14,70.77
  Bottom 1.016: Q10.2 155.33,50.09 154.47,50.95 154.47,67.05 158.2,70.77 R29.1 166.14,70.77 166.83,70.77 166.86,70.74 | R30.1 173.68,70.78 173.76,70.7 174.25,70.7 R31.1
N$47  (via drill 0.35)
  Top 0.508: v172.91,2.71 177.71,2.71 179.18,4.18 v179.18,7.31 179.18,10.05 177.9,11.34 169.17,11.34 v167.79,12.71
  Bottom 0.508: U8.2 171.6,4.02 v172.91,2.71 | v179.18,7.31 178.33,8.16 R32.1 | R33.2 169.25,11.31 167.82,12.74 v167.79,12.71
N$49
  Bottom 0.508: U8.1 171.6,6.36 172.54,7.3 173.34,7.3 | 173.34,7.3 176.77,7.3 177.66,6.41 177.66,5.99 Q11.B | R34.1 173.62,7.58 173.34,7.3
N$50  (via drill 0.35)
  Top 0.508: v173.71,5.05 168.61,5.05 166.78,6.87 166.78,9.05 v166.75,9.05
  Bottom 0.508: Q11.C 175.28,5.05 v173.71,5.05 | v166.75,9.05 165.63,10.17 Q12.1
N$51
  Bottom 1.27: Q12.2 155.35,7.89 151.75,11.49 151.75,18.34 155.36,21.95 155.36,28.81 157.37,30.82 161.63,30.82 R37.1 168.58,31.07 R35.1 168.62,31.07 R36.1
NEG(-)
  Top 1.27: U$1.4 93.37,26.75 94.74,28.11 104.33,28.11 | 104.33,28.11 105.36,27.09 105.36,25.42 U$2.4 | 104.33,28.11 116.37,28.11 117.42,27.07 117.42,25.35 U$3.4 | 8.72,53.59 POWERMETER1.N 7.99,53.61 16.69,53.61 31.91,38.39 74.13,38.39 77.41,35.11 77.41,17.64 72.17,12.39 X6.3
  Bottom 1.016: X6.3 72.17,12.34 85.25,25.41 U$1.4
PLC-A  (via drill 1)
  Top 1.016: v80.71,5.89 82.74,7.93 82.74,83.31 75.19,90.86 POWERMETER1.V1
  Top 1.27: X2.1 94.03,6.96 90.84,10.15 90.84,17.28 91.77,18.21 U$1.2
  Bottom 1.016: U$1.2 89.89,18.21 80.73,9.04 80.73,6.21 80.71,6.18 v80.71,5.89
PLC-B
  Top 1.016: X2.2 107.44,4.58 104.73,1.88 90.72,1.88 85.75,6.85 85.75,87.46 78.51,94.69 49.93,94.69 47.99,92.75 POWERMETER1.V2
  Top 1.27: X2.2 107.44,7.89 102.72,12.62 102.72,17.02 103.86,18.16 U$2.2
PLC-C
  Top 1.27: X2.3 112.52,10.2 114.55,12.23 114.55,16.68 116,18.12 U$3.2
  Bottom 1.016: X2.3 112.52,3.21 111.39,2.08 61.24,2.08 58.73,4.58 58.73,11.04 82.62,34.92 82.62,87.75 75.56,94.81 40.04,94.81 37.83,92.6 POWERMETER1.V3
PLC-N  (via drill 1)
  Top 1.27: X2.4 117.6,10.47 119.06,11.93 124.89,11.93 126.83,13.88 126.83,19.29 124.4,21.72 U$3.3 117.36,21.76 U$2.3 105.25,21.81 U$1.3 | v78.72,13.34 80.22,14.84 80.22,37.55 76.02,41.75 33.3,41.75 27.65,47.4 27.65,90.83 POWERMETER1.VN
  Bottom 1.016: U$1.3 87.21,21.81 78.73,13.33 v78.72,13.34
POS(+)
  Top 1.016: 7.68,43.14 POWERMETER1.L
  Top 1.27: X6.2 67.09,12.11 74.03,19.05 74.03,32.28 71.46,34.85 16.55,34.85 POWERMETER1.L
  Bottom 1.016: X6.2 67.09,12.07 83.56,28.54 100.9,28.54
  Bottom 1.27: D6.C 99.7,27.34 100.9,28.54 109.68,28.54 | 109.68,28.54 111.28,26.94 111.28,24.66 D7.C | 109.68,28.54 121.79,28.54 123.22,27.11 123.22,24.75 D8.C
(copper drawn outside any net)
  shapes: Top area x3